# EAGLE design Temp (EAGLE 9.2.1)
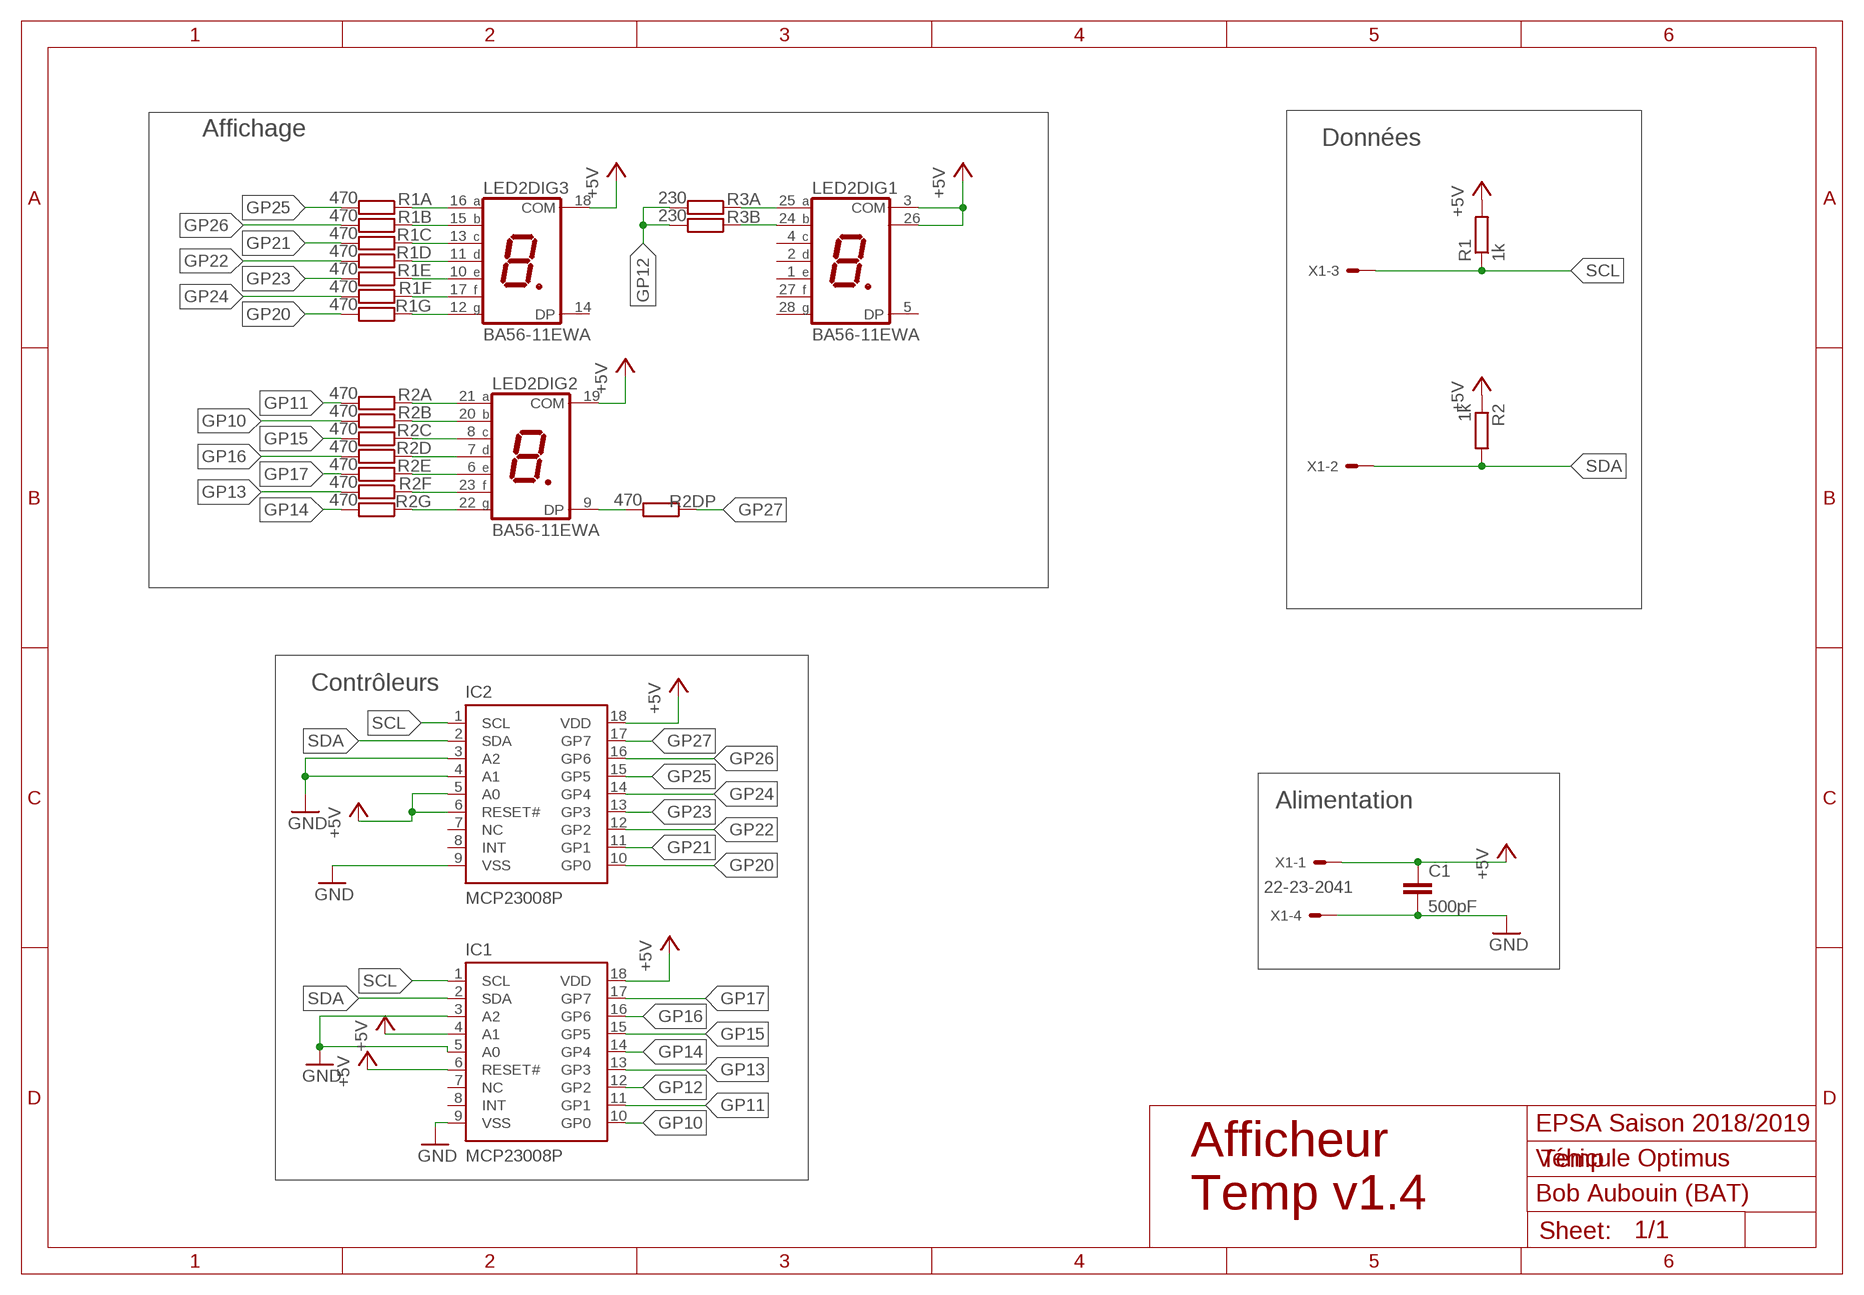
[diagram p0: schematic, sheet 1]

## Parts
C1  500pF  C-EU025-025X050  [C025-025X050]
IC1  MCP23008P  [DIL18]
IC2  MCP23008P  [DIL18]
LED2  BA56-11EWA  [BA/BC56]
R1  1k  R-EU_0204/7  [0204/7]
R1A  470  R-EU_0204/7  [0204/7]
R1B  470  R-EU_0204/7  [0204/7]
R1C  470  R-EU_0204/7  [0204/7]
R1D  470  R-EU_0204/7  [0204/7]
R1E  470  R-EU_0204/7  [0204/7]
R1F  470  R-EU_0204/7  [0204/7]
R1G  470  R-EU_0204/7  [0204/7]
R2  1k  R-EU_0204/7  [0204/7]
R2A  470  R-EU_0204/7  [0204/7]
R2B  470  R-EU_0204/7  [0204/7]
R2C  470  R-EU_0204/7  [0204/7]
R2D  470  R-EU_0204/7  [0204/7]
R2DP  470  R-EU_0204/7  [0204/7]
R2E  470  R-EU_0204/7  [0204/7]
R2F  470  R-EU_0204/7  [0204/7]
R2G  470  R-EU_0204/7  [0204/7]
R3A  230  R-EU_0204/7  [0204/7]
R3B  230  R-EU_0204/7  [0204/7]
X1  22-23-2041  [22-23-2041]

## Nets
+5V: C1.1 IC1.4(A1) IC1.6(RESET#) IC1.18(VDD) IC2.5(A0) IC2.6(RESET#) IC2.18(VDD) LED2.3(DIG1:COM) LED2.18(DIG3:COM) LED2.19(DIG2:COM) LED2.26(DIG1:COM) R1.2 R2.1 X1.1
GND: C1.2 IC1.3(A2) IC1.5(A0) IC1.9(VSS) IC2.3(A2) IC2.4(A1) IC2.9(VSS) X1.4
GP10: IC1.10(GP0) R2B.2
GP11: IC1.11(GP1) R2A.2
GP12: IC1.12(GP2) R3A.2 R3B.2
GP13: IC1.13(GP3) R2F.2
GP14: IC1.14(GP4) R2G.2
GP15: IC1.15(GP5) R2C.2
GP16: IC1.16(GP6) R2D.2
GP17: IC1.17(GP7) R2E.2
GP20: IC2.10(GP0) R1G.2
GP21: IC2.11(GP1) R1C.2
GP22: IC2.12(GP2) R1D.2
GP23: IC2.13(GP3) R1E.2
GP24: IC2.14(GP4) R1F.2
GP25: IC2.15(GP5) R1A.2
GP26: IC2.16(GP6) R1B.2
GP27: IC2.17(GP7) R2DP.1
N$1: LED2.16(DIG3:A) R1A.1
N$2: LED2.15(DIG3:B) R1B.1
N$3: LED2.13(DIG3:C) R1C.1
N$4: LED2.11(DIG3:D) R1D.1
N$5: LED2.10(DIG3:E) R1E.1
N$6: LED2.17(DIG3:F) R1F.1
N$7: LED2.12(DIG3:G) R1G.1
N$8: LED2.21(DIG2:A) R2A.1
N$9: LED2.20(DIG2:B) R2B.1
N$10: LED2.8(DIG2:C) R2C.1
N$11: LED2.7(DIG2:D) R2D.1
N$12: LED2.6(DIG2:E) R2E.1
N$13: LED2.23(DIG2:F) R2F.1
N$14: LED2.22(DIG2:G) R2G.1
N$15: LED2.9(DIG2:DP) R2DP.2
N$16: LED2.24(DIG1:B) R3B.1
N$17: LED2.25(DIG1:A) R3A.1
SCL: IC1.1(SCL) IC2.1(SCL) R1.1 X1.3
SDA: IC1.2(SDA) IC2.2(SDA) R2.2 X1.2
Unconnected: IC1.7(NC) IC1.8(INT) IC2.7(NC) IC2.8(INT) LED2.1(DIG1:E) LED2.2(DIG1:D) LED2.4(DIG1:C) LED2.5(DIG1:DP) LED2.14(DIG3:DP) LED2.27(DIG1:F) LED2.28(DIG1:G)

## Notes on the sheet
- Affichage
- Données
- Contrôleurs
- Alimentation
- EPSA Saison 2018/2019
- Véhicule Optimus
- Bob Aubouin (BAT)
- Afficheur 
  Temp v1.4

## Library data of the parts
C1 = rcl:C-EU: CAPACITOR, European symbol; SPICEPREFIX: C
IC1 IC2 = microchip-dspic:MCP23008: 8-Bit I/O Expander with I2C Interface
LED2 = display-kingbright:B?56-11*WA: 14.22mm (0.56INCH) THREE DIGIT NUMERIC DISPLAY Source: http://www.kingbright.com .. BA56-11EWA(Ver1189474895.pdf; OC_FARNELL: unknown; OC_NEWARK: unknown
R1 R1A R1B R1C R1D R1E R1F R1G R2 R2A R2B R2C R2D R2DP R2E R2F R2G R3A R3B = rcl:R-EU_: RESISTOR, European symbol; SPICEPREFIX: R
X1 = con-molex:22-23-2041: .100" (2.54mm) Center Header - 4 Pin; MF: MOLEX; MPN: 22-23-2041; OC_FARNELL: 1462920; OC_NEWARK: 38C0355

## Board
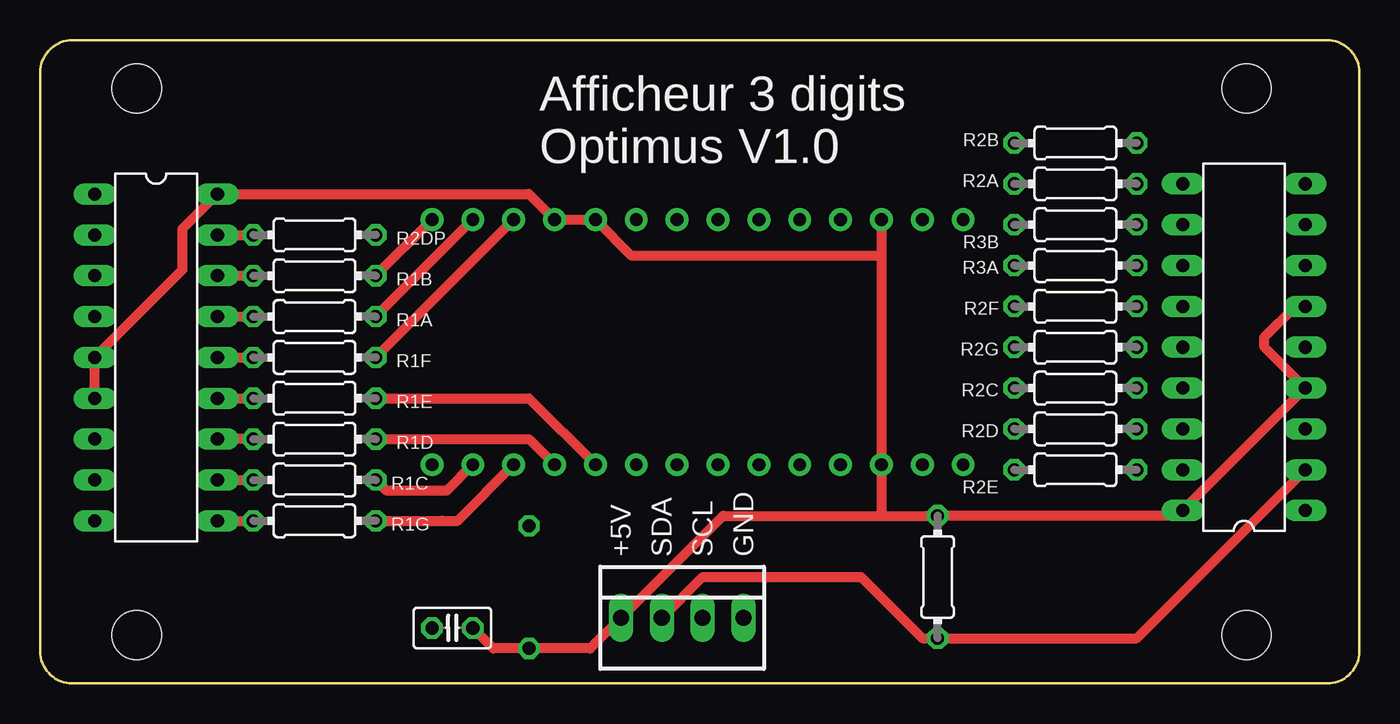
[diagram p1: board, top side]
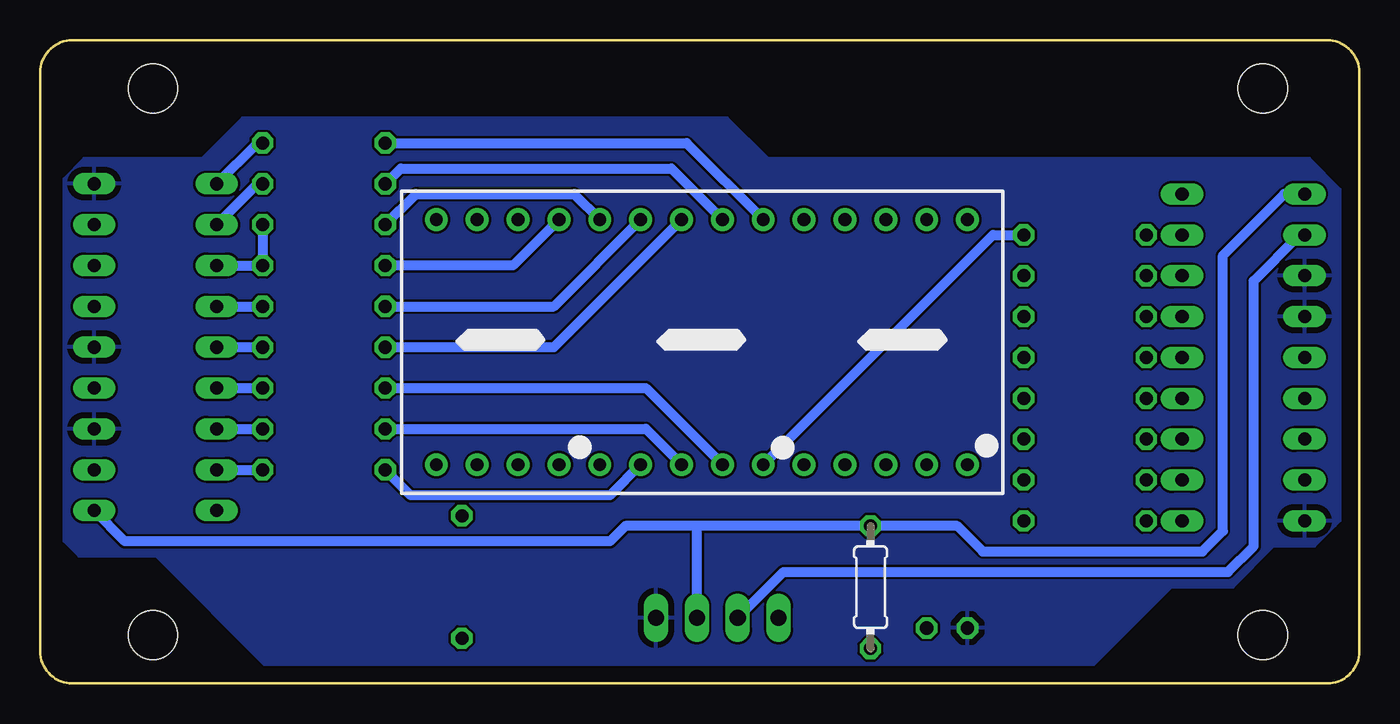
[diagram p2: board, bottom side, seen from below]

Size 82 x 40 mm. Coordinates in mm from the lower left corner, seen from the top.
Outline: 82,38 82,2 arc-90 80,0 2,0 arc-90 0,2 0,38 arc-90 2,40 80,40 arc-90 82,38
Copper layers (1*16): Top 0.035mm / dielectric 1.5mm / Bottom 0.035mm
Design rules "default *": minimum track width 6mil, minimum drill 0.35mm, track to track 6mil, track to pad 6mil, pad to pad 6mil, via to via 6mil, smd to smd 6mil, copper to edge 40mil, drill to drill 6mil, minimum pad ring 10mil, minimum via ring 8mil, stop-mask expansion 4mil, vias tented up to drill 0mil, thermal gap 15mil
Holes 3.05 mm at 75,3 6,3 6,37 75,37

### Footprints (pad centres in the part's own frame; a part is rotated, then mirrored left to right if it is on the bottom)
C025-025X050 = drill 0.813 octagon: 1 -1.27,0; 2 1.27,0
DIL18 = drill 0.813 long: 1 -10.16,-3.81; 2 -7.62,-3.81; 3 -5.08,-3.81; 4 -2.54,-3.81; 5 0,-3.81; 6 2.54,-3.81; 7 5.08,-3.81; 8 7.62,-3.81; 9 10.16,-3.81; 10 10.16,3.81; 11 7.62,3.81; 12 5.08,3.81; 13 2.54,3.81; 14 0,3.81; 15 -2.54,3.81; 16 -5.08,3.81; 17 -7.62,3.81; 18 -10.16,3.81
BA/BC56 = drill 0.8 pad 1.422: 1 -16.51,-7.62; 2 -13.97,-7.62; 3 -11.43,-7.62; 4 -8.89,-7.62; 5 -6.35,-7.62; 6 -3.81,-7.62; 7 -1.27,-7.62; 8 1.27,-7.62; 9 3.81,-7.62; 10 6.35,-7.62; 11 8.89,-7.62; 12 11.43,-7.62; 13 13.97,-7.62; 14 16.51,-7.62; 15 16.51,7.62; 16 13.97,7.62; 17 11.43,7.62; 18 8.89,7.62; 19 6.35,7.62; 20 3.81,7.62; 21 1.27,7.62; 22 -1.27,7.62; 23 -3.81,7.62; 24 -6.35,7.62; 25 -8.89,7.62; 26 -11.43,7.62; 27 -13.97,7.62; 28 -16.51,7.62
0204/7 = drill 0.813 octagon: 1 -3.81,0; 2 3.81,0
22-23-2041 = drill 1 long: 1 -3.81,0; 2 -1.27,0; 3 1.27,0; 4 3.81,0

### Placement (x,y rotation side)
C1  25.62,3.45 180 top
IC1  74.83,20.91 90 top
IC2  7.21,20.27 270 top
LED2  40.86,21.23 0 bottom
R1  30.38,5.99 270 bottom
R1A  17.05,22.81 180 top
R1B  17.05,25.35 180 top
R1C  17.05,12.65 180 top
R1D  17.05,15.19 180 top
R1E  17.05,17.73 180 top
R1F  17.05,20.27 180 top
R1G  17.05,10.11 180 top
R2  55.78,6.62 270 top
R2A  64.36,31.07 0 top
R2B  64.36,33.61 0 top
R2C  64.36,18.37 0 top
R2D  64.36,15.83 0 top
R2DP  17.05,27.89 0 top
R2E  64.36,13.29 0 top
R2F  64.36,23.45 0 top
R2G  64.36,20.91 0 top
R3A  64.36,25.99 0 top
R3B  64.36,28.53 0 top
X1  39.91,4.08 0 top

### Tracks (layer width: path | path; a pad name or v marks a point on that pad's centre or on a via)
+5V
  Top 0.152: IC2.18 11.01,30.43
  Top 0.61: 52.29,10.43 R2.1 70.71,10.43 IC1.18 IC1.4 76.11,20.91 76.11,21.54 78.01,23.45 IC1.6 | 52.29,10.43 42.45,10.43 X1.1 34.2,2.17 R1.2 28.16,2.17 C1.1 | IC2.6 IC2.5 8.83,25.71 8.83,28.26 11.01,30.43 | IC2.18 30.38,30.43 LED2.18 LED2.19 36.73,26.62 52.29,26.62 | 52.29,10.43 LED2.3 52.29,26.62 | LED2.26 52.29,26.62
GND
  pour Bottom: 1.17,23.45 1.17,30.75 3.08,32.66 36.73,32.66 39.27,35.2 69.44,35.2 71.98,32.66 72.93,32.66 78.33,32.66 79.28,32.66 80.55,31.38 80.55,8.84 79.6,7.89 76.11,7.89 74.83,7.89 67.85,0.91 16.73,0.91 11.65,5.99 7.84,5.99 5.3,8.53 2.76,8.53 1.49,9.79 1.17,10.11
GP10
  Bottom 0.61: IC1.10 68.48,33.61 R2B.2
GP11
  Bottom 0.61: IC1.11 68.48,31.07 R2A.2
GP12
  Bottom 0.61: R3B.2 R3A.2 IC1.12
GP13
  Bottom 0.61: IC1.13 R2F.2
GP14
  Bottom 0.61: IC1.14 R2G.2
GP15
  Bottom 0.61: IC1.15 R2C.2
GP16
  Bottom 0.61: IC1.16 R2D.2
GP17
  Bottom 0.61: IC1.17 R2E.2
GP20
  Top 0.61: IC2.10 R1G.2
GP21
  Top 0.61: IC2.11 R1C.2
GP22
  Top 0.61: R1D.2 IC2.12
GP23
  Top 0.61: IC2.13 R1E.2
GP24
  Top 0.61: IC2.14 R1F.2
GP25
  Top 0.61: IC2.15 R1A.2
GP26
  Top 0.61: IC2.16 R1B.2
GP27
  Top 0.61: IC2.17 R2DP.1
N$1
  Top 0.61: R1A.1 LED2.16
N$2
  Top 0.61: R1B.1 LED2.15
N$3
  Top 0.61: R1C.1 21.5,12.02 25.3,12.02 LED2.13
N$4
  Top 0.61: R1D.1 30.38,15.19 LED2.11
N$5
  Top 0.61: R1E.1 30.38,17.73 LED2.10
N$6
  Top 0.61: R1F.1 LED2.17
N$7
  Top 0.61: R1G.1 24.99,10.11 25.94,10.11 LED2.12
N$8
  Bottom 0.61: R2A.1 59.59,32.02 42.77,32.02 LED2.21
N$9
  Bottom 0.61: R2B.1 41.81,33.61 LED2.20
N$10
  Bottom 0.61: R2C.1 44.35,18.37 LED2.8
N$11
  Bottom 0.61: R2D.1 44.35,15.83 LED2.7
N$12
  Bottom 0.61: R2E.1 58.96,11.7 | 58.96,11.7 46.58,11.7 LED2.6 | 58.96,11.7
N$13
  Bottom 0.61: R2F.1 50.07,23.45 LED2.23
N$14
  Bottom 0.61: R2G.1 50.07,20.91 LED2.22
N$15
  Bottom 0.61: LED2.9 22.77,27.89 R2DP.2
N$16
  Bottom 0.61: R3B.1 58.64,30.43 48.8,30.43 LED2.24
N$17
  Bottom 0.61: LED2.25 52.61,25.99 R3A.1
SCL
  Bottom 0.61: IC2.1 4.67,30.43 8.48,26.62 8.48,9.48 9.75,8.21 23.4,8.21 24.99,9.79 R1.1 41.18,9.79 | 41.18,9.79 45.62,9.79 46.58,8.84 76.74,8.84 IC1.1 | X1.3 41.18,9.79
SDA
  Top 0.61: X1.2 41.18,6.62 51.02,6.62 54.83,2.81 R2.2 68.17,2.81 IC1.2
  Bottom 0.61: X1.2 35.78,6.94 8.16,6.94 6.57,8.53 6.57,25.04 3.71,27.89 IC2.2

### Text on the board
tPlace: +5V | SDA | SCL | GND
tNames: Afficheur 3 digits / Optimus V1.0